# Altium schematic sheet 02_H7_IO.SchDoc: =GlobalProjectName
size 594 x 420 mm; ApprovedBy: Галкин; CheckedBy: Галкин; Author: Данич; SheetNumber: 2; SheetTotal: 8; PageSetup: Record=PageOptions|CenterHorizontal=True|CenterVertical=True|PrintScale=0.70|XCorrection=1.00|YCorrection=1.00|PrintKind=2|BorderSize=5000000|LeftOffset=9000|BottomOffset=10100|Orientation=2|PaperLength=11176|PaperWidth=8636|Scale=100|PaperSource=259|PrintQuality=-3|MediaType=1|DitherType=10|PrintScaleMode=1|PaperKind=A3|PaperIndex=8
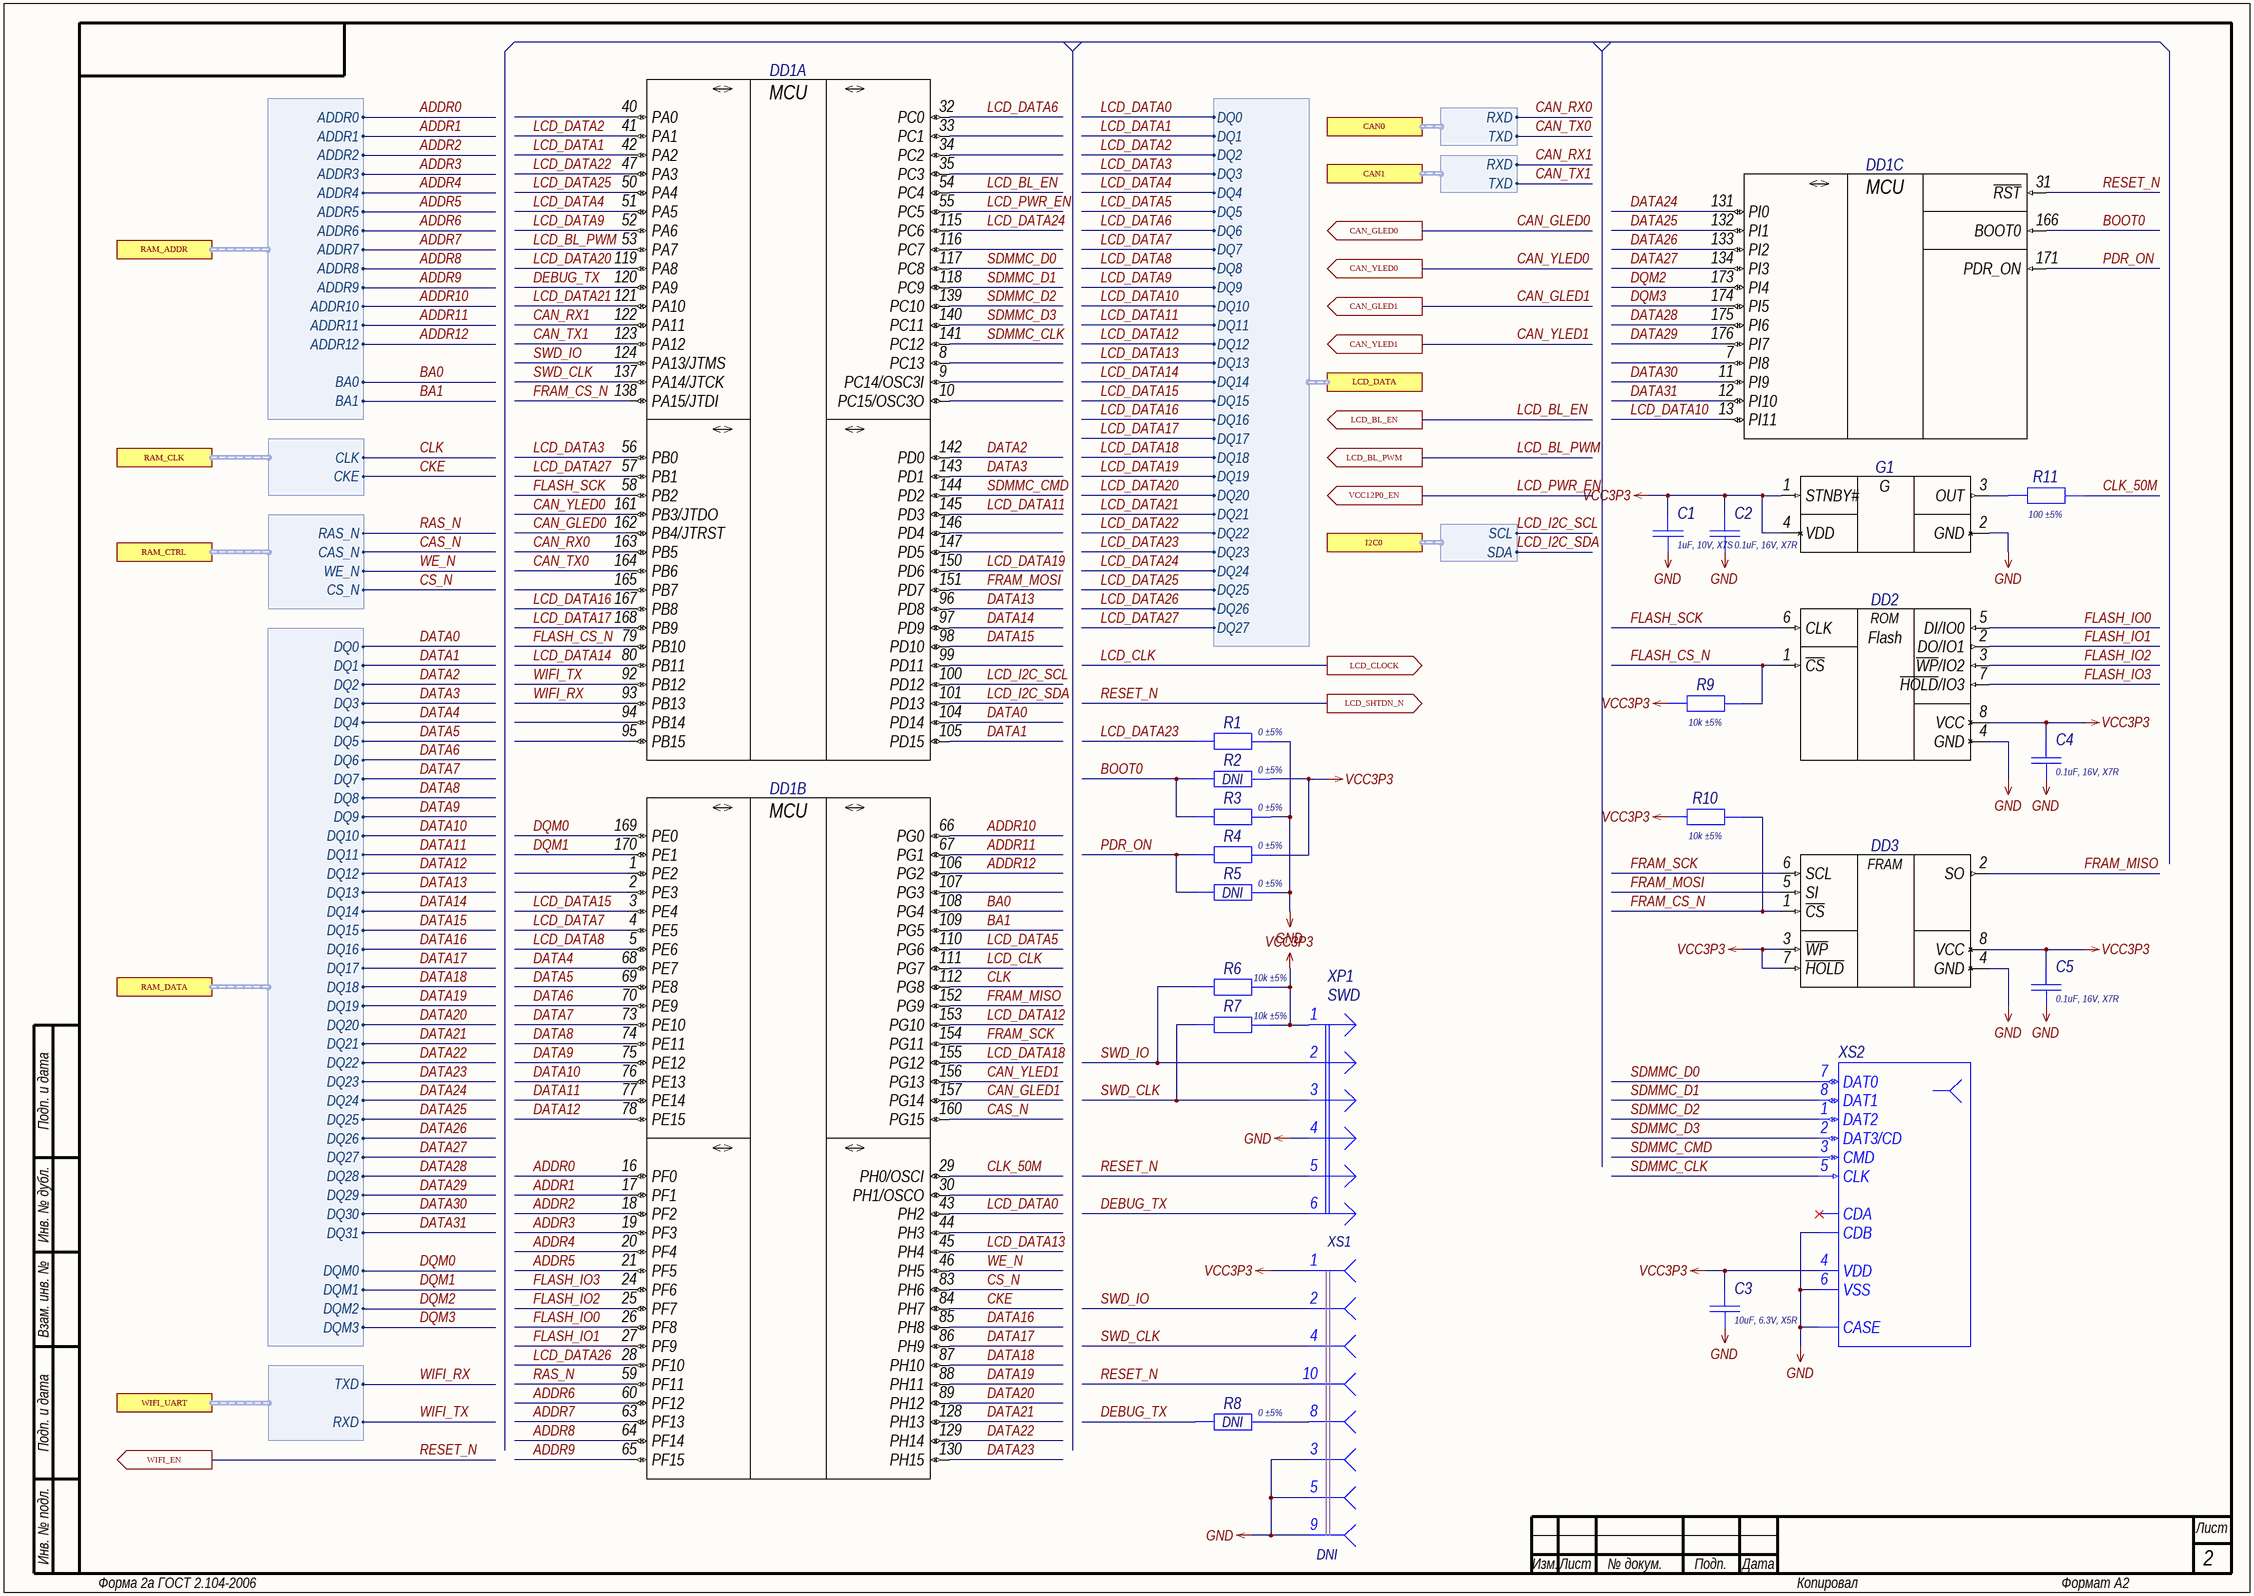
[diagram p0: 02_H7_IO.SchDoc]

## Parts
C1  Schematic Value: 1uF, 10V, X7S  [C0402_L]  (hidden comment: Capacitor)
C2  Schematic Value: 0.1uF, 16V, X7R  [C0402_L]  (hidden comment: Capacitor)
C3  Schematic Value: 10uF, 6.3V, X5R  [C0402_L]  (hidden comment: Capacitor)
C4  Schematic Value: 0.1uF, 16V, X7R  [C0402_L]  (hidden comment: Capacitor)
C5  Schematic Value: 0.1uF, 16V, X7R  [C0402_L]  (hidden comment: Capacitor)
DD1  STM32H743IxT6-Series  [LQFP-176_050P2400X2400X160_N]  (value not drawn)  (parts A,B,C of 4)
DD2  W25Q-Series  [SOIC-8_127P528X528X203_N]  (value not drawn)
DD3  FM25CL64Bx-Series  [SOIC-8_127P490X391X155_N]  (value not drawn)
G1  DSC100X-Series  [CDFN-4_165P250X200X085_N]  (value not drawn)
R1  Schematic Value: 0 ±5%  [R0402_L]  (hidden comment: Resistor)
R2  Schematic Value: 0 ±5%  [R0402_L]  (hidden comment: Resistor)  (no BOM)
R3  Schematic Value: 0 ±5%  [R0402_L]  (hidden comment: Resistor)
R4  Schematic Value: 0 ±5%  [R0402_L]  (hidden comment: Resistor)
R5  Schematic Value: 0 ±5%  [R0402_L]  (hidden comment: Resistor)  (no BOM)
R6  Schematic Value: 10k ±5%  [R0402_L]  (hidden comment: Resistor)
R7  Schematic Value: 10k ±5%  [R0402_L]  (hidden comment: Resistor)
R8  Schematic Value: 0 ±5%  [R0402_L]  (hidden comment: Resistor)  (no BOM)
R9  Schematic Value: 10k ±5%  [R0402_L]  (hidden comment: Resistor)
R10  Schematic Value: 10k ±5%  [R0402_L]  (hidden comment: Resistor)
R11  Schematic Value: 100 ±5%  [R0402_L]  (hidden comment: Resistor)
XP1  SWD  [CWF-6R]
XS1  JTAG  [XF2M-1015-1A]  (value not drawn)  (parts A,B,C,D,E,H,I,J of 10)  (no BOM)
XS2  DM3AT-SF-PEJM5  [DM3AT-SF-PEJM5]  (value not drawn)

## Ports
CAN0 (harness CAN), CAN1 (harness CAN), CAN_GLED0 (out), CAN_GLED1 (out), CAN_YLED0 (out), CAN_YLED1 (out), I2C0 (harness I2C), LCD_BL_EN (out), LCD_BL_PWM (out), LCD_CLOCK (out), LCD_DATA (harness LCD_DQ), LCD_SHTDN_N (out), RAM_ADDR (harness SDRAM_ADDR), RAM_CLK (harness SDRAM_CLK), RAM_CTRL (harness SDRAM_ADDR_CTRL), RAM_DATA (harness SDRAM_DQ), VCC12P0_EN (out), WIFI_EN (out), WIFI_UART (harness UART0)

## Harnesses
SDRAM_ADDR: BA0, BA1, ADDR12, ADDR11, ADDR10, ADDR9, ADDR8, ADDR7, ADDR6, ADDR5, ADDR4, ADDR3, ADDR2, ADDR1, ADDR0
SDRAM_ADDR_CTRL: RAS_N, CAS_N, WE_N, CS_N
SDRAM_CLK: CLK, CKE
SDRAM_DQ: DQ0, DQ1, DQ2, DQ3, DQ4, DQ5, DQ6, DQ7, DQ8, DQ9, DQ10, DQ11, DQ12, DQ13, DQ14, DQ15, DQ16, DQ17, DQ18, DQ19, DQ20, DQ21, DQ22, DQ23, DQ24, DQ25, DQ26, DQ27, DQ28, DQ29, DQ30, DQ31, DQM0, DQM1, DQM2, DQM3
LCD_DQ: DQ0, DQ1, DQ2, DQ3, DQ4, DQ5, DQ6, DQ7, DQ8, DQ9, DQ10, DQ11, DQ12, DQ13, DQ14, DQ15, DQ16, DQ17, DQ18, DQ19, DQ20, DQ21, DQ22, DQ23, DQ24, DQ25, DQ26, DQ27
UART0: RXD, TXD
CAN: RXD, TXD
I2C: SCL, SDA

## Nets
GND: C1.1 C2.1 C3.1 C4.1 C5.1 DD2.4(GND) DD3.4(GND) G1.2(GND) R1.2 R3.2 R5.2 XP1.4 XS1.3 XS1.5 XS1.9 XS2.6(VSS) XS2.CASE XS2.CDB
VCC3P3: C1.2 C2.2 C3.2 C4.2 C5.2 DD2.8(VCC) DD3.3(~{WP}) DD3.7(~{HOLD}) DD3.8(VCC) G1.1(STNBY#) G1.4(VDD) R2.2 R4.2 R6.1 R7.1 R9.2 R10.2 XP1.1 XS1.1 XS2.4(VDD)
ADDR0: DD1.16(PF0) ; port RAM_ADDR.ADDR0
ADDR1: DD1.17(PF1) ; port RAM_ADDR.ADDR1
ADDR2: DD1.18(PF2) ; port RAM_ADDR.ADDR2
ADDR3: DD1.19(PF3) ; port RAM_ADDR.ADDR3
ADDR4: DD1.20(PF4) ; port RAM_ADDR.ADDR4
ADDR5: DD1.21(PF5) ; port RAM_ADDR.ADDR5
ADDR6: DD1.60(PF12) ; port RAM_ADDR.ADDR6
ADDR7: DD1.63(PF13) ; port RAM_ADDR.ADDR7
ADDR8: DD1.64(PF14) ; port RAM_ADDR.ADDR8
ADDR9: DD1.65(PF15) ; port RAM_ADDR.ADDR9
ADDR10: DD1.66(PG0) ; port RAM_ADDR.ADDR10
ADDR11: DD1.67(PG1) ; port RAM_ADDR.ADDR11
ADDR12: DD1.106(PG2) ; port RAM_ADDR.ADDR12
BA0: DD1.108(PG4) ; port RAM_ADDR.BA0
BA1: DD1.109(PG5) ; port RAM_ADDR.BA1
BOOT0: DD1.166(BOOT0) R2.1 R3.1
CAN_GLED0: DD1.162(PB4/JTRST) ; port CAN_GLED0
CAN_GLED1: DD1.157(PG14) ; port CAN_GLED1
CAN_RX0: DD1.163(PB5) ; port CAN0.RXD
CAN_RX1: DD1.122(PA11) ; port CAN1.RXD
CAN_TX0: DD1.164(PB6) ; port CAN0.TXD
CAN_TX1: DD1.123(PA12) ; port CAN1.TXD
CAN_YLED0: DD1.161(PB3/JTDO) ; port CAN_YLED0
CAN_YLED1: DD1.156(PG13) ; port CAN_YLED1
CAS_N: DD1.160(PG15) ; port RAM_CTRL.CAS_N
CKE: DD1.84(PH7) ; port RAM_CLK.CKE
CLK: DD1.112(PG8) ; port RAM_CLK.CLK
CLK_50M: DD1.29(PH0/OSCI) R11.2
CS_N: DD1.83(PH6) ; port RAM_CTRL.CS_N
DATA0: DD1.104(PD14) ; port RAM_DATA.DQ0
DATA1: DD1.105(PD15) ; port RAM_DATA.DQ1
DATA2: DD1.142(PD0) ; port RAM_DATA.DQ2
DATA3: DD1.143(PD1) ; port RAM_DATA.DQ3
DATA4: DD1.68(PE7) ; port RAM_DATA.DQ4
DATA5: DD1.69(PE8) ; port RAM_DATA.DQ5
DATA6: DD1.70(PE9) ; port RAM_DATA.DQ6
DATA7: DD1.73(PE10) ; port RAM_DATA.DQ7
DATA8: DD1.74(PE11) ; port RAM_DATA.DQ8
DATA9: DD1.75(PE12) ; port RAM_DATA.DQ9
DATA10: DD1.76(PE13) ; port RAM_DATA.DQ10
DATA11: DD1.77(PE14) ; port RAM_DATA.DQ11
DATA12: DD1.78(PE15) ; port RAM_DATA.DQ12
DATA13: DD1.96(PD8) ; port RAM_DATA.DQ13
DATA14: DD1.97(PD9) ; port RAM_DATA.DQ14
DATA15: DD1.98(PD10) ; port RAM_DATA.DQ15
DATA16: DD1.85(PH8) ; port RAM_DATA.DQ16
DATA17: DD1.86(PH9) ; port RAM_DATA.DQ17
DATA18: DD1.87(PH10) ; port RAM_DATA.DQ18
DATA19: DD1.88(PH11) ; port RAM_DATA.DQ19
DATA20: DD1.89(PH12) ; port RAM_DATA.DQ20
DATA21: DD1.128(PH13) ; port RAM_DATA.DQ21
DATA22: DD1.129(PH14) ; port RAM_DATA.DQ22
DATA23: DD1.130(PH15) ; port RAM_DATA.DQ23
DATA24: DD1.131(PI0) ; port RAM_DATA.DQ24
DATA25: DD1.132(PI1) ; port RAM_DATA.DQ25
DATA26: DD1.133(PI2) ; port RAM_DATA.DQ26
DATA27: DD1.134(PI3) ; port RAM_DATA.DQ27
DATA28: DD1.175(PI6) ; port RAM_DATA.DQ28
DATA29: DD1.176(PI7) ; port RAM_DATA.DQ29
DATA30: DD1.11(PI9) ; port RAM_DATA.DQ30
DATA31: DD1.12(PI10) ; port RAM_DATA.DQ31
DEBUG_TX: DD1.120(PA9) R8.1 XP1.6
DQM0: DD1.169(PE0) ; port RAM_DATA.DQM0
DQM1: DD1.170(PE1) ; port RAM_DATA.DQM1
DQM2: DD1.173(PI4) ; port RAM_DATA.DQM2
DQM3: DD1.174(PI5) ; port RAM_DATA.DQM3
FLASH_CS_N: DD1.79(PB10) DD2.1(~{CS}) R9.1
FLASH_IO0: DD1.26(PF8) DD2.5(DI/IO0)
FLASH_IO1: DD1.27(PF9) DD2.2(DO/IO1)
FLASH_IO2: DD1.25(PF7) DD2.3(~{WP}/IO2)
FLASH_IO3: DD1.24(PF6) DD2.7(~{HOLD}/IO3)
FLASH_SCK: DD1.58(PB2) DD2.6(CLK)
FRAM_CS_N: DD1.138(PA15/JTDI) DD3.1(~{CS}) R10.1
FRAM_MISO: DD1.152(PG9) DD3.2(SO)
FRAM_MOSI: DD1.151(PD7) DD3.5(SI)
FRAM_SCK: DD1.154(PG11) DD3.6(SCL)
LCD_BL_EN: DD1.54(PC4) ; port LCD_BL_EN
LCD_BL_PWM: DD1.53(PA7) ; port LCD_BL_PWM
LCD_CLK: DD1.111(PG7) ; port LCD_CLOCK
LCD_DATA0: DD1.43(PH2) ; port LCD_DATA.DQ0
LCD_DATA1: DD1.42(PA2) ; port LCD_DATA.DQ1
LCD_DATA2: DD1.41(PA1) ; port LCD_DATA.DQ2
LCD_DATA3: DD1.56(PB0) ; port LCD_DATA.DQ3
LCD_DATA4: DD1.51(PA5) ; port LCD_DATA.DQ4
LCD_DATA5: DD1.110(PG6) ; port LCD_DATA.DQ5
LCD_DATA6: DD1.32(PC0) ; port LCD_DATA.DQ6
LCD_DATA7: DD1.4(PE5) ; port LCD_DATA.DQ7
LCD_DATA8: DD1.5(PE6) ; port LCD_DATA.DQ8
LCD_DATA9: DD1.52(PA6) ; port LCD_DATA.DQ9
LCD_DATA10: DD1.13(PI11) ; port LCD_DATA.DQ10
LCD_DATA11: DD1.145(PD3) ; port LCD_DATA.DQ11
LCD_DATA12: DD1.153(PG10) ; port LCD_DATA.DQ12
LCD_DATA13: DD1.45(PH4) ; port LCD_DATA.DQ13
LCD_DATA14: DD1.80(PB11) ; port LCD_DATA.DQ14
LCD_DATA15: DD1.3(PE4) ; port LCD_DATA.DQ15
LCD_DATA16: DD1.167(PB8) ; port LCD_DATA.DQ16
LCD_DATA17: DD1.168(PB9) ; port LCD_DATA.DQ17
LCD_DATA18: DD1.155(PG12) ; port LCD_DATA.DQ18
LCD_DATA19: DD1.150(PD6) ; port LCD_DATA.DQ19
LCD_DATA20: DD1.119(PA8) ; port LCD_DATA.DQ20
LCD_DATA21: DD1.121(PA10) ; port LCD_DATA.DQ21
LCD_DATA22: DD1.47(PA3) ; port LCD_DATA.DQ22
LCD_DATA23: R1.1 ; port LCD_DATA.DQ23
LCD_DATA24: DD1.115(PC6) ; port LCD_DATA.DQ24
LCD_DATA25: DD1.50(PA4) ; port LCD_DATA.DQ25
LCD_DATA26: DD1.28(PF10) ; port LCD_DATA.DQ26
LCD_DATA27: DD1.57(PB1) ; port LCD_DATA.DQ27
LCD_I2C_SCL: DD1.100(PD12) ; port I2C0.SCL
LCD_I2C_SDA: DD1.101(PD13) ; port I2C0.SDA
LCD_PWR_EN: DD1.55(PC5) ; port VCC12P0_EN
PDR_ON: DD1.171(PDR_ON) R4.1 R5.1
RAS_N: DD1.59(PF11) ; port RAM_CTRL.RAS_N
RESET_N: DD1.31(~{RST}) XP1.5 XS1.10 ; port LCD_SHTDN_N, port WIFI_EN
SDMMC_CLK: DD1.141(PC12) XS2.5(CLK)
SDMMC_CMD: DD1.144(PD2) XS2.3(CMD)
SDMMC_D0: DD1.117(PC8) XS2.7(DAT0)
SDMMC_D1: DD1.118(PC9) XS2.8(DAT1)
SDMMC_D2: DD1.139(PC10) XS2.1(DAT2)
SDMMC_D3: DD1.140(PC11) XS2.2(DAT3/CD)
SWD_CLK: DD1.137(PA14/JTCK) R7.2 XP1.3 XS1.4
SWD_IO: DD1.124(PA13/JTMS) R6.2 XP1.2 XS1.2
WE_N: DD1.46(PH5) ; port RAM_CTRL.WE_N
WIFI_RX: DD1.93(PB13) ; port WIFI_UART.TXD
WIFI_TX: DD1.92(PB12) ; port WIFI_UART.RXD
NetG1_3: G1.3(OUT) R11.1
NetR8_2: R8.2 XS1.8

Not connected (* = marked no-connect by the designer): DD1 1(PE2) 2(PE3) 7(PI8) 8(PC13) 9(PC14/OSC3I) 10(PC15/OSC3O) 30(PH1/OSCO) 33(PC1) 34(PC2) 35(PC3) 40(PA0) 44(PH3) 94(PB14) 95(PB15) 99(PD11) 107(PG3) 116(PC7) 146(PD4) 147(PD5) 165(PB7); XS2 CDA*

## Notes on the sheet
- (near R2) DNI
- (near R5) DNI
- XS1
- (near R8) DNI
- (near XS1) DNI
- Подп. и дата
- Инв. № дубл.
- Взам. инв. №
- Инв. № подл.
- Изм.
- Лист
- № докум.
- Подп.
- Дата
- Форма 2а ГОСТ 2.104-2006
- Копировал
- Формат А2
- (in symbol DSC1001DI5-050.0000) G
- (in symbol FM25CL64B-G) FRAM
- (in symbol STM32H743IIT6, part A) MCU
- (in symbol STM32H743IIT6, part B) MCU
- (in symbol STM32H743IIT6, part C) MCU
- (in symbol W25Q128JVSIQ) ROM; Flash

## Library data of the parts
C1 = GRM155C71A105KE11D: Manufacturer: Murata; Type: Конденсатор; ID: 179; Value: 1uF; Voltage: 10V; Tolerance: ±10%; Dielectric Type: X7S; Application Category: 1; Working Temperature Min: -55°С; Working Temperature Max: +125°С; Published: 18.05.2010; Publisher: Andrew Danich; Part Number: GRM155C71A105KE11D; Footprint: 0402
C2 C4 C5 = GCM155R71C104KA55D: Manufacturer: Murata; Type: Конденсатор; ID: 163; Value: 0.1uF; Voltage: 16V; Tolerance: ±10%; Dielectric Type: X7R; Application Category: 1; Working Temperature Min: -55°С; Working Temperature Max: +125°С; Functional Analog: GRM155R71C104KA88D; Published: 18.05.2010; Publisher: Andrew Danich; Part Number: GCM155R71C104KA55D; Footprint: 0402
C3 = GRM155R60J106ME15D: Manufacturer: Murata; Type: Конденсатор; ID: 234; Value: 10uF; Voltage: 6.3V; Tolerance: ±20%; Dielectric Type: X5R; Application Category: 1; Working Temperature Min: -55°С; Working Temperature Max: +85°С; Published: 18.05.2010; Publisher: Andrew Danich; Part Number: GRM155R60J106ME15D; Footprint: 0402
DD1 = STM32H743IIT6: Manufacturer: STMicroelectronics; ID: 36; Supply Operation: +1.62…3.6V; Flash: 2M; SRAM: 1M; Prog Interface: JTAG, SWD, UART, USB; I/O Lines: 140; Operation Frequency: 400MHz; Application Category: 1; Working Temperature Min: -40°С; Working Temperature Max: +85°С; Published: 19.05.2020; Publisher: Andrew Danich; Type: Микросхема; Part Number: STM32H743IIT6; Value: STM32H743IIT6
DD2 = W25Q128JVSIQ: Manufacturer: Winbond; ID: 21; Supply Operation: +2.7…3.6V; Supply Current: 25mA; Memory: 16M; Addressable: NO; Clock Frequency: 133MHz; Application Category: 1; Working Temperature Min: -40°С; Working Temperature Max: +85°С; Interface: SPI; Published: 11.06.2017; Type: Микросхема; Publisher: Andrew Danich; Part Number: W25Q128JVSIQ; Value: W25Q128JVSIQ
DD3 = FM25CL64B-G: Manufacturer: Cypress Semiconductor; ID: 2; Supply Operation: +2.7…3.6V; Supply Current: 3mA; Memory: 64Kb; Addressable: NO; Interface: SPI; Clock Frequency: 20MHz; Application Category: 1; Working Temperature Min: -40°С; Working Temperature Max: +85°С; Functional Analog: FM25CL64B-GTR; Published: 21.05.2020; Type: Микросхема; Publisher: Andrew Danich; Part Number: FM25CL64B-G; Value: FM25CL64B-G
G1 = DSC1001DI5-050.0000: Manufacturer: Microchip; ID: 12; Supply Operation: +1.7…3.6V; Supply Current: 8.5mA; Output Voltage: 0.2VCC…0.8VCC; Temperature Coefficient: 10ppm; Shutdown Input: Yes; Output Signal: CMOS; Output Frequency: 50MHz; Application Category: 1; Working Temperature Min: -40°С; Working Temperature Max: +85°С; Functional Analog: DSC1001DI5-050.0000T; Published: 07.06.2018; Publisher: Andrew Danich; Type: Генератор; Part Number: DSC1001DI5-050.0000; Value: DSC1001DI5-050.0000
R1-R5 R8 = RC0402JR-070RL: Manufacturer: Yageo; ID: 362; Value: 0; Limit Voltage: 50V; Tolerance: ±5%; Temperature Coefficient: 100ppm; Total Power Dissipation: 0.1W; Series Type: Thick-Film; Application Category: 1; Working Temperature Min: -55°С; Working Temperature Max: +155°С; Published: 24.03.2010; Publisher: Andrew Danich; Type: Резистор; Part Number: RC0402JR-070RL; Footprint: 0402
R6 R7 R9 R10 = RC0402JR-0710KL: Manufacturer: Yageo; ID: 476; Value: 10k; Limit Voltage: 50V; Tolerance: ±5%; Temperature Coefficient: 100ppm; Total Power Dissipation: 0.1W; Series Type: Thick-Film; Application Category: 1; Working Temperature Min: -55°С; Working Temperature Max: +155°С; Published: 24.03.2010; Publisher: Andrew Danich; Type: Резистор; Part Number: RC0402JR-0710KL; Footprint: 0402
R11 = RC0402JR-07100RL: Manufacturer: Yageo; ID: 479; Value: 100; Limit Voltage: 50V; Tolerance: ±5%; Temperature Coefficient: 100ppm; Total Power Dissipation: 0.1W; Series Type: Thick-Film; Application Category: 1; Working Temperature Min: -55°С; Working Temperature Max: +155°С; Published: 24.03.2010; Publisher: Andrew Danich; Type: Резистор; Part Number: RC0402JR-07100RL; Footprint: 0402
XP1 = CWF-6R: Manufacturer: Ningbo Zhenqin Electronic; Value: CWF-6R; ID: 128; Limit Voltage: 250V; Limit Current: 3A; Connector Type: Male; Surface Finish: Phosphor Bronze; Pitch: 2.5mm; Application Category: 1; Working Temperature Min: -30°С; Working Temperature Max: +90°С; Functional Analog: DS1069-6 MR; Published: 07.03.2013; Publisher: Andrew Danich; Type: Вилка; Part Number: CWF-6R; Pins: 6
XS1 = XF2M-1015-1A: Manufacturer: Omron Electronics; ID: 7; Limit Voltage: 50V; Limit Current: 500mA; Connector Type: Female; Resistance: 0.05ohm; Pitch: 0.5mm; Application Category: 1; Working Temperature Min: -30°С; Working Temperature Max: +85°С; Published: 07.09.2015; Publisher: Viktor Klishin; Type: Розетка; Part Number: XF2M-1015-1A; Value: XF2M-1015-1A; Pins: 10; Series: FPC
XS2 = DM3AT-SF-PEJM5: Manufacturer: Hirose Connector; ID: 5; Limit Voltage: 125V; Style: Push-Push; Connector Type: microSD Card; Interface: SPI\SDIO; Pitch: 1.1mm; Application Category: 1; Working Temperature Min: -25°С; Working Temperature Max: +85°С; Value: DM3AT-SF-PEJM5; Published: 14.03.2019; Publisher: Andrew Danich; Type: Розетка; Part Number: DM3AT-SF-PEJM5; Pins: 10